# EAGLE schematic ENGI301 Project Actual (EAGLE 8.7.1)
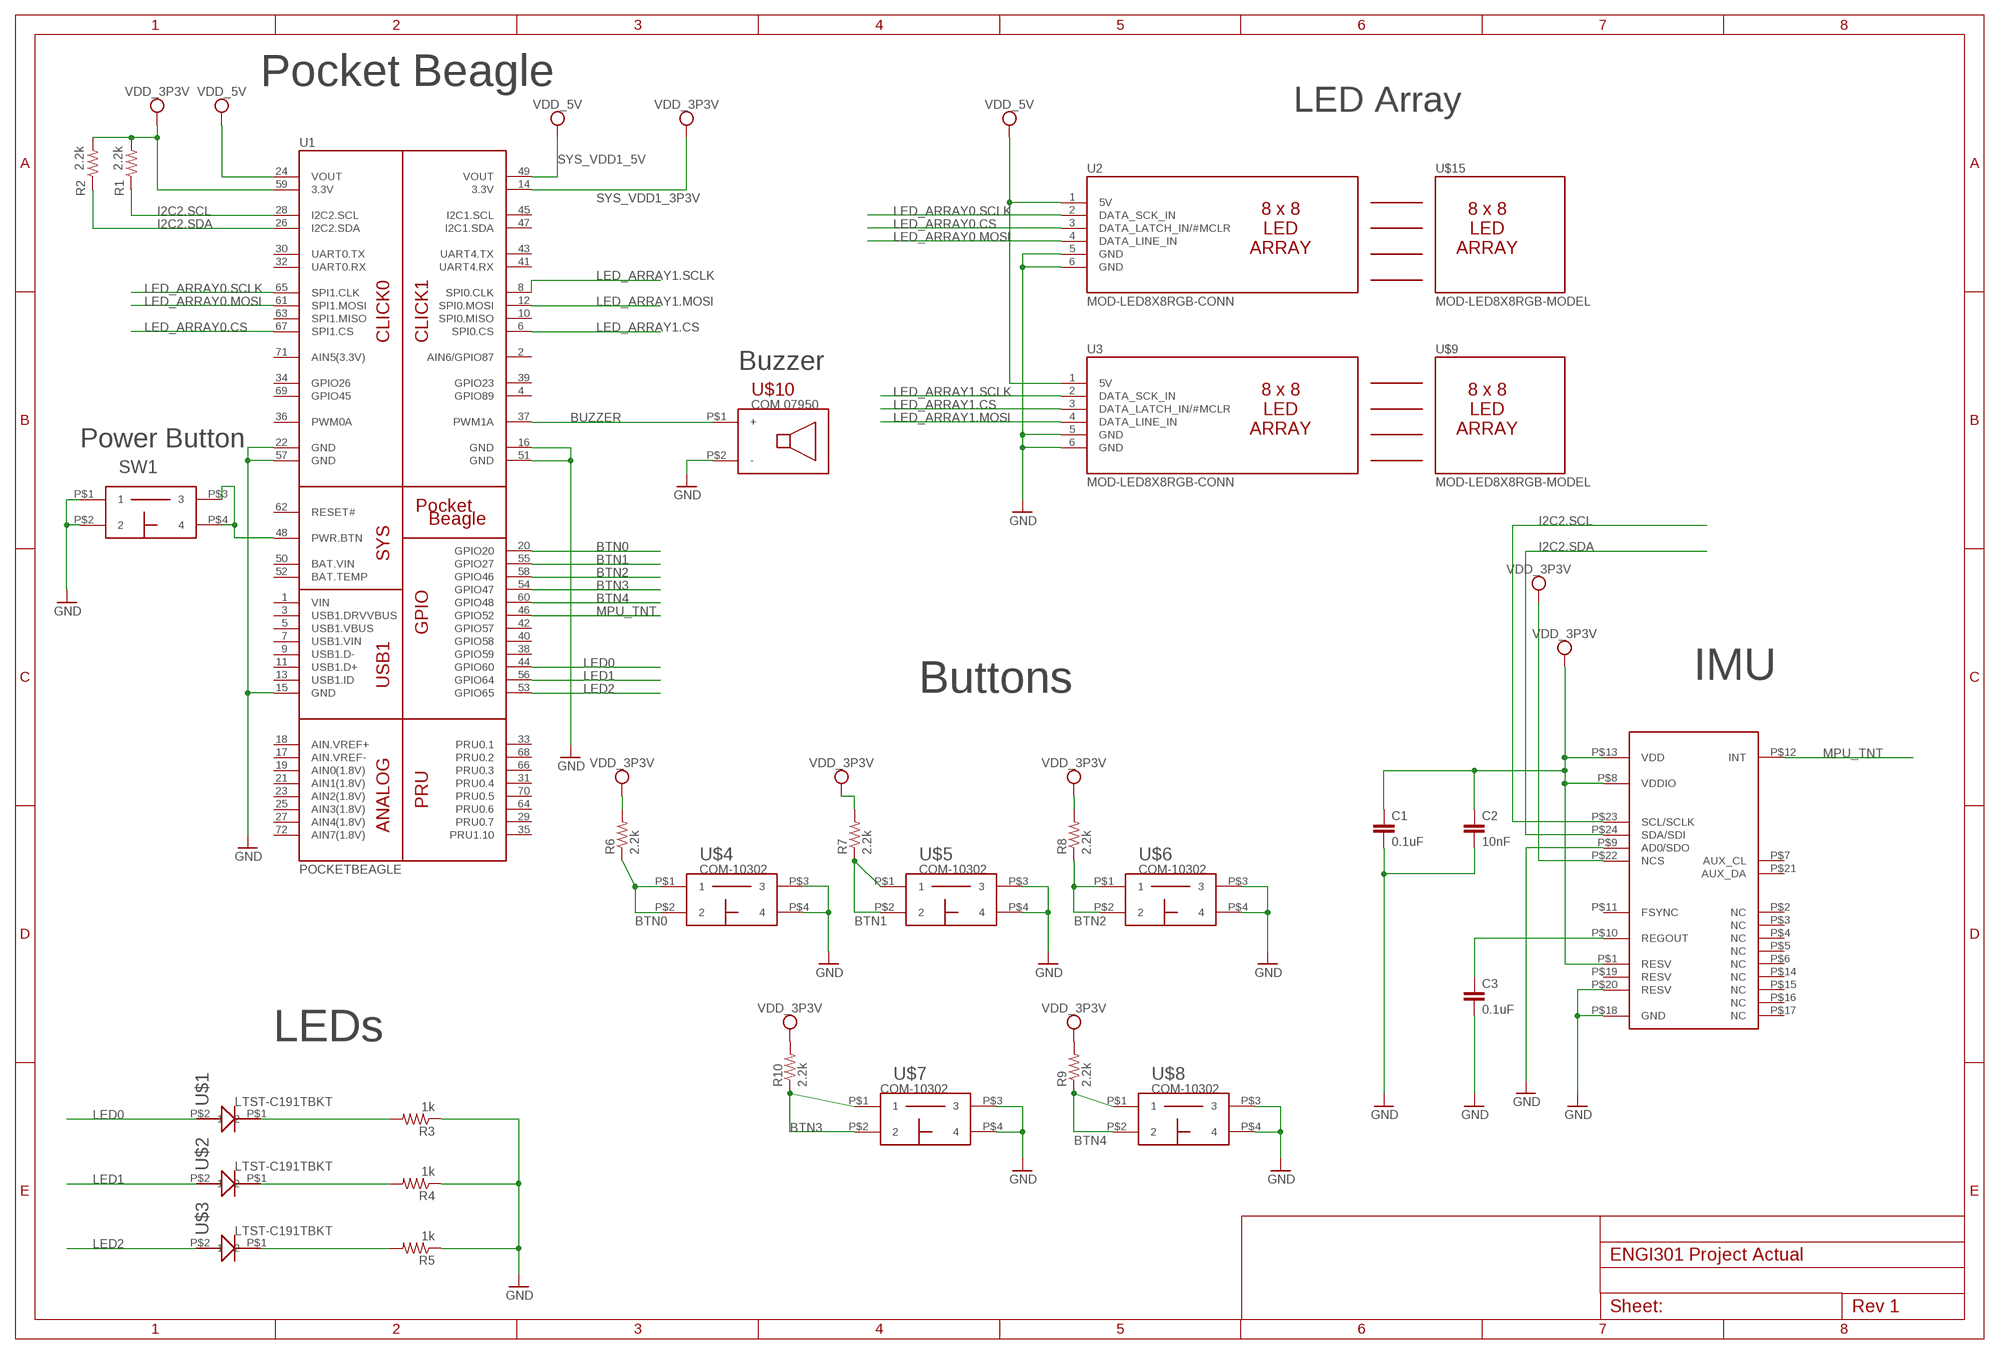
[diagram p0: schematic, sheet 1]

## Parts
C1  0.1uF  C_C0603  [C0603]
C2  10nF  C_C0603  [C0603]
C3  0.1uF  C_C0603  [C0603]
R1  2.2k  R_R0603  [R0603]
R2  2.2k  R_R0603  [R0603]
R3  1k  R_R0603  [R0603]
R4  1k  R_R0603  [R0603]
R5  1k  R_R0603  [R0603]
R6  2.2k  R_R0603  [R0603]
R7  2.2k  R_R0603  [R0603]
R8  2.2k  R_R0603  [R0603]
R9  2.2k  R_R0603  [R0603]
R10  2.2k  R_R0603  [R0603]
SW1  BUTTON  [BUTTON]
U1  POCKETBEAGLE  [POCKETBEAGLE]
U2  MOD-LED8X8RGB-CONN  [FE06W]
U3  MOD-LED8X8RGB-CONN  [FE06W]
U6  MPU-9250  [QFN3]
U$1  LED  [LED]
U$2  LED  [LED]
U$3  LED  [LED]
U$4  BUTTON  [BUTTON]
U$5  BUTTON  [BUTTON]
U$6  BUTTON  [BUTTON]
U$7  BUTTON  [BUTTON]
U$8  BUTTON  [BUTTON]
U$10  BUZZER  [BUZZER]

## Nets
BTN0: R6.1 U1.20(GPIO20) U$4.P$1 U$4.P$2
BTN1: R7.1 U1.55(GPIO27) U$5.P$1 U$5.P$2
BTN2: R8.1 U1.58(GPIO46) U$6.P$1 U$6.P$2
BTN3: R10.1 U1.54(GPIO47) U$7.P$1 U$7.P$2
BTN4: R9.1 U1.60(GPIO48) U$8.P$1 U$8.P$2
BUZZER: U1.37(PWM1A) U$10.P$1(+)
GND: C1.2 C2.2 C3.2 R3.1 R4.1 R5.1 SW1.P$1 SW1.P$2 U1.15(GND) U1.16(GND) U1.22(GND) U1.51(GND) U1.57(GND) U2.5(GND) U2.6(GND) U3.5(GND) U3.6(GND) U6.P$9(AD0/SDO) U6.P$18(GND) U6.P$20(RESV) U$4.P$3 U$4.P$4 U$5.P$3 U$5.P$4 U$6.P$3 U$6.P$4 U$7.P$3 U$7.P$4 U$8.P$3 U$8.P$4 U$10.P$2(-)
I2C2.SCL: R1.1 U1.28(I2C2.SCL) U6.P$23(SCL/SCLK)
I2C2.SDA: R2.1 U1.26(I2C2.SDA) U6.P$24(SDA/SDI)
LED0: U1.44(GPIO60) U$1.P$2
LED1: U1.56(GPIO64) U$2.P$2
LED2: U1.53(GPIO65) U$3.P$2
LED_ARRAY0.CS: U1.67(SPI1.CS) U2.3(DATA_LATCH_IN/#MCLR)
LED_ARRAY0.MOSI: U1.61(SPI1.MOSI) U2.4(DATA_LINE_IN)
LED_ARRAY0.SCLK: U1.65(SPI1.CLK) U2.2(DATA_SCK_IN)
LED_ARRAY1.CS: U1.6(SPI0.CS) U3.3(DATA_LATCH_IN/#MCLR)
LED_ARRAY1.MOSI: U1.12(SPI0.MOSI) U3.4(DATA_LINE_IN)
LED_ARRAY1.SCLK: U1.8(SPI0.CLK) U3.2(DATA_SCK_IN)
MPU_TNT: U1.46(GPIO52) U6.P$12(INT)
N$1: SW1.P$3 SW1.P$4 U1.48(PWR.BTN)
N$23: R3.2 U$1.P$1
N$24: R4.2 U$2.P$1
N$25: R5.2 U$3.P$1
N$32: C3.1 U6.P$10(REGOUT)
SYS_VDD1_3P3V: C1.1 C2.1 R1.2 R2.2 R6.2 R7.2 R8.2 R9.2 R10.2 U1.14(3.3V) U1.59(3.3V) U6.P$1(RESV) U6.P$8(VDDIO) U6.P$13(VDD) U6.P$22(NCS) ; supply symbol labelled VDD_3P3V
SYS_VDD1_5V: U1.24(VOUT) U1.49(VOUT) U2.1(5V) U3.1(5V) ; supply symbol labelled VDD_5V
Unconnected: U1.1(VIN) U1.2(AIN6/GPIO87) U1.3(USB1.DRVVBUS) U1.4(GPIO89) U1.5(USB1.VBUS) U1.7(USB1.VIN) U1.9(USB1.D-) U1.10(SPI0.MISO) U1.11(USB1.D+) U1.13(USB1.ID) U1.17(AIN.VREF-) U1.18(AIN.VREF+) U1.19(AIN0(1.8V)) U1.21(AIN1(1.8V)) U1.23(AIN2(1.8V)) U1.25(AIN3(1.8V)) U1.27(AIN4(1.8V)) U1.29(PRU0.7) U1.30(UART0.TX) U1.31(PRU0.4) U1.32(UART0.RX) U1.33(PRU0.1) U1.34(GPIO26) U1.35(PRU1.10) U1.36(PWM0A) U1.38(GPIO59) U1.39(GPIO23) U1.40(GPIO58) U1.41(UART4.RX) U1.42(GPIO57) U1.43(UART4.TX) U1.45(I2C1.SCL) U1.47(I2C1.SDA) U1.50(BAT.VIN) U1.52(BAT.TEMP) U1.62(RESET#) U1.63(SPI1.MISO) U1.64(PRU0.6) U1.66(PRU0.3) U1.68(PRU0.2) U1.69(GPIO45) U1.70(PRU0.5) U1.71(AIN5(3.3V)) U1.72(AIN7(1.8V)) U6.P$2(NC) U6.P$3(NC) U6.P$4(NC) U6.P$5(NC) U6.P$6(NC) U6.P$7(AUX_CL) U6.P$11(FSYNC) U6.P$14(NC) U6.P$15(NC) U6.P$16(NC) U6.P$17(NC) U6.P$19(RESV) U6.P$21(AUX_DA)

## Notes on the sheet
- Pocket Beagle
- LED Array
- Buzzer
- COM 07950
- Power Button
- IMU
- Buttons
- COM-10302 | COM-10302 | COM-10302
- LEDs
- COM-10302 | COM-10302
- LTST-C191TBKT
- LTST-C191TBKT
- LTST-C191TBKT

## Library data of the parts
C1-C3 = ENGI301 Project 2a:C_: Capacitor SMD. Sizes: 0402, 0603 & 0805
R1-R10 = ENGI301 Project 2a:R_: RESISTOR, American symbol
SW1 U$4-U$8 = ENGI301 Project 2a:BUTTON
U1 = ENGI301 Project 2a:POCKETBEAGLE
U2 U3 = ENGI301 Project 2a:MOD-LED8X8RGB-CONN
U6 = ENGI301 Project 2a:MPU-9250
U$1-U$3 = ENGI301 Project 2a:LED
U$10 = ENGI301 Project 2a:BUZZER